# Altium schematic sheet 万能贴片转直插板.SCHDOC
size A4
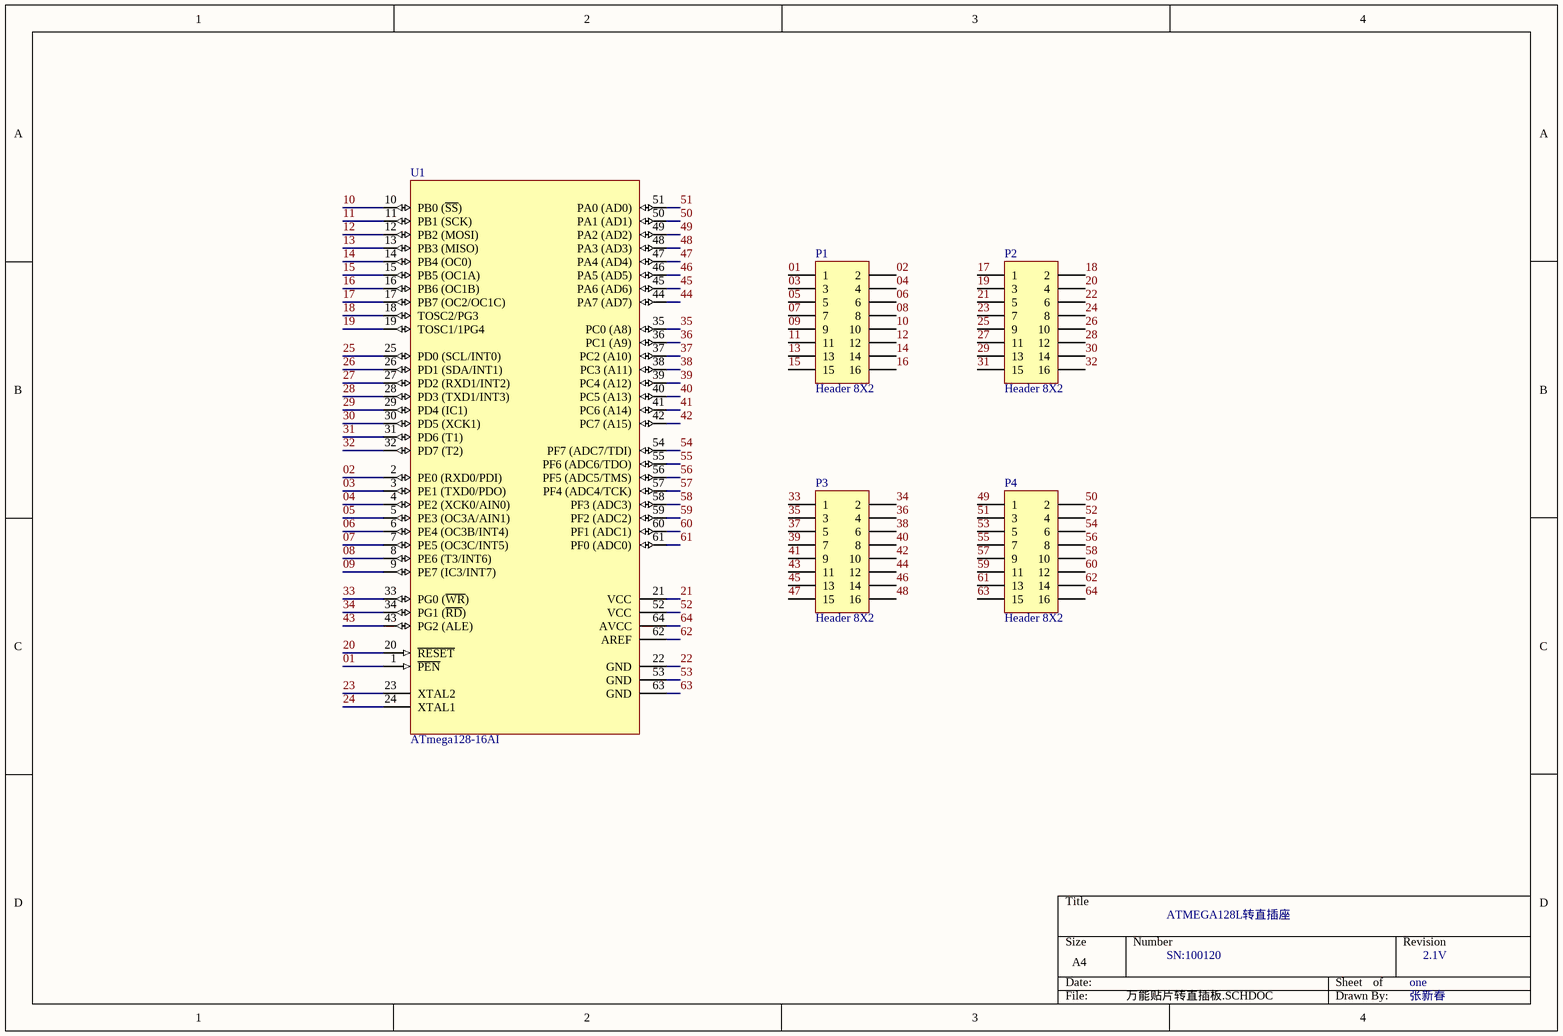
[diagram p0: 万能贴片转直插板.SCHDOC]

## Parts
P1  Header 8X2  [HDR2X8]
P2  Header 8X2  [HDR2X8]
P3  Header 8X2  [HDR2X8]
P4  Header 8X2  [HDR2X8]
U1  ATmega128-16AI  [wanneng_2]

## Nets
01: P1.1 U1.1(~{PEN})
02: P1.2 U1.2(PE0_(RXD0/PDI))
03: P1.3 U1.3(PE1_(TXD0/PDO))
04: P1.4 U1.4(PE2_(XCK0/AIN0))
05: P1.5 U1.5(PE3_(OC3A/AIN1))
06: P1.6 U1.6(PE4_(OC3B/INT4))
07: P1.7 U1.7(PE5_(OC3C/INT5))
08: P1.8 U1.8(PE6_(T3/INT6))
09: P1.9 U1.9(PE7_(IC3/INT7))
10: P1.10 U1.10(PB0_(~{SS}))
11: P1.11 U1.11(PB1_(SCK))
12: P1.12 U1.12(PB2_(MOSI))
13: P1.13 U1.13(PB3_(MISO))
14: P1.14 U1.14(PB4_(OC0))
15: P1.15 U1.15(PB5_(OC1A))
16: P1.16 U1.16(PB6_(OC1B))
17: P2.1 U1.17(PB7_(OC2/OC1C))
18: P2.2 U1.18(TOSC2/PG3)
19: P2.3 U1.19(TOSC1/1PG4)
20: P2.4 U1.20(~{RESET})
21: P2.5 U1.21(VCC)
22: P2.6 U1.22(GND)
23: P2.7 U1.23(XTAL2)
24: P2.8 U1.24(XTAL1)
25: P2.9 U1.25(PD0_(SCL/INT0))
26: P2.10 U1.26(PD1_(SDA/INT1))
27: P2.11 U1.27(PD2_(RXD1/INT2))
28: P2.12 U1.28(PD3_(TXD1/INT3))
29: P2.13 U1.29(PD4_(IC1))
30: P2.14 U1.30(PD5_(XCK1))
31: P2.15 U1.31(PD6_(T1))
32: P2.16 U1.32(PD7_(T2))
33: P3.1 U1.33(PG0_(~{WR}))
34: P3.2 U1.34(PG1_(~{RD}))
35: P3.3 U1.35(PC0_(A8))
36: P3.4 U1.36(PC1_(A9))
37: P3.5 U1.37(PC2_(A10))
38: P3.6 U1.38(PC3_(A11))
39: P3.7 U1.39(PC4_(A12))
40: P3.8 U1.40(PC5_(A13))
41: P3.9 U1.41(PC6_(A14))
42: P3.10 U1.42(PC7_(A15))
43: P3.11 U1.43(PG2_(ALE))
44: P3.12 U1.44(PA7_(AD7))
45: P3.13 U1.45(PA6_(AD6))
46: P3.14 U1.46(PA5_(AD5))
47: P3.15 U1.47(PA4_(AD4))
48: P3.16 U1.48(PA3_(AD3))
49: P4.1 U1.49(PA2_(AD2))
50: P4.2 U1.50(PA1_(AD1))
51: P4.3 U1.51(PA0_(AD0))
52: P4.4 U1.52(VCC)
53: P4.5 U1.53(GND)
54: P4.6 U1.54(PF7_(ADC7/TDI))
55: P4.7 U1.55(PF6_(ADC6/TDO))
56: P4.8 U1.56(PF5_(ADC5/TMS))
57: P4.9 U1.57(PF4_(ADC4/TCK))
58: P4.10 U1.58(PF3_(ADC3))
59: P4.11 U1.59(PF2_(ADC2))
60: P4.12 U1.60(PF1_(ADC1))
61: P4.13 U1.61(PF0_(ADC0))
62: P4.14 U1.62(AREF)
63: P4.15 U1.63(GND)
64: P4.16 U1.64(AVCC)

## Notes on the sheet
- ATMEGA128L转直插座
- SN:100120
- one
- 2.1V
- 张新春

## Library data of the parts
P1-P4 = Header 8X2: Header, 8-Pin, Dual row; LatestRevisionDate: 17-Jul-2002; LatestRevisionNote: Re-released for DXP Platform.; Publisher: Altium Limited
U1 = ATmega128-16AI: 8-Bit AVR Microcontroller with 128K Bytes of In-System Programmable Flash Memory; PackageDocument: revB, Oct-2001; Published: 17-Sep-2003; LatestRevisionDate: 4-Mar-2005; LatestRevisionNote: Stylized 3D Model Added.; DatasheetDocument: 2467G-AVR-09/02; PackageReference: 64A; Publisher: Altium Limited; Code_JEDEC: MS-026-AEB; ComponentLink1Description: Manufacturer Link; ComponentLink1URL: http://www.atmel.com; ComponentLink2Description: Datasheet; ComponentLink2URL: http://www.atmel.com/dyn/resources/prod_documents/doc2467.pdf